# EAGLE schematic BK8000L BREADBOARD BUDDY (EAGLE 7.6.0)
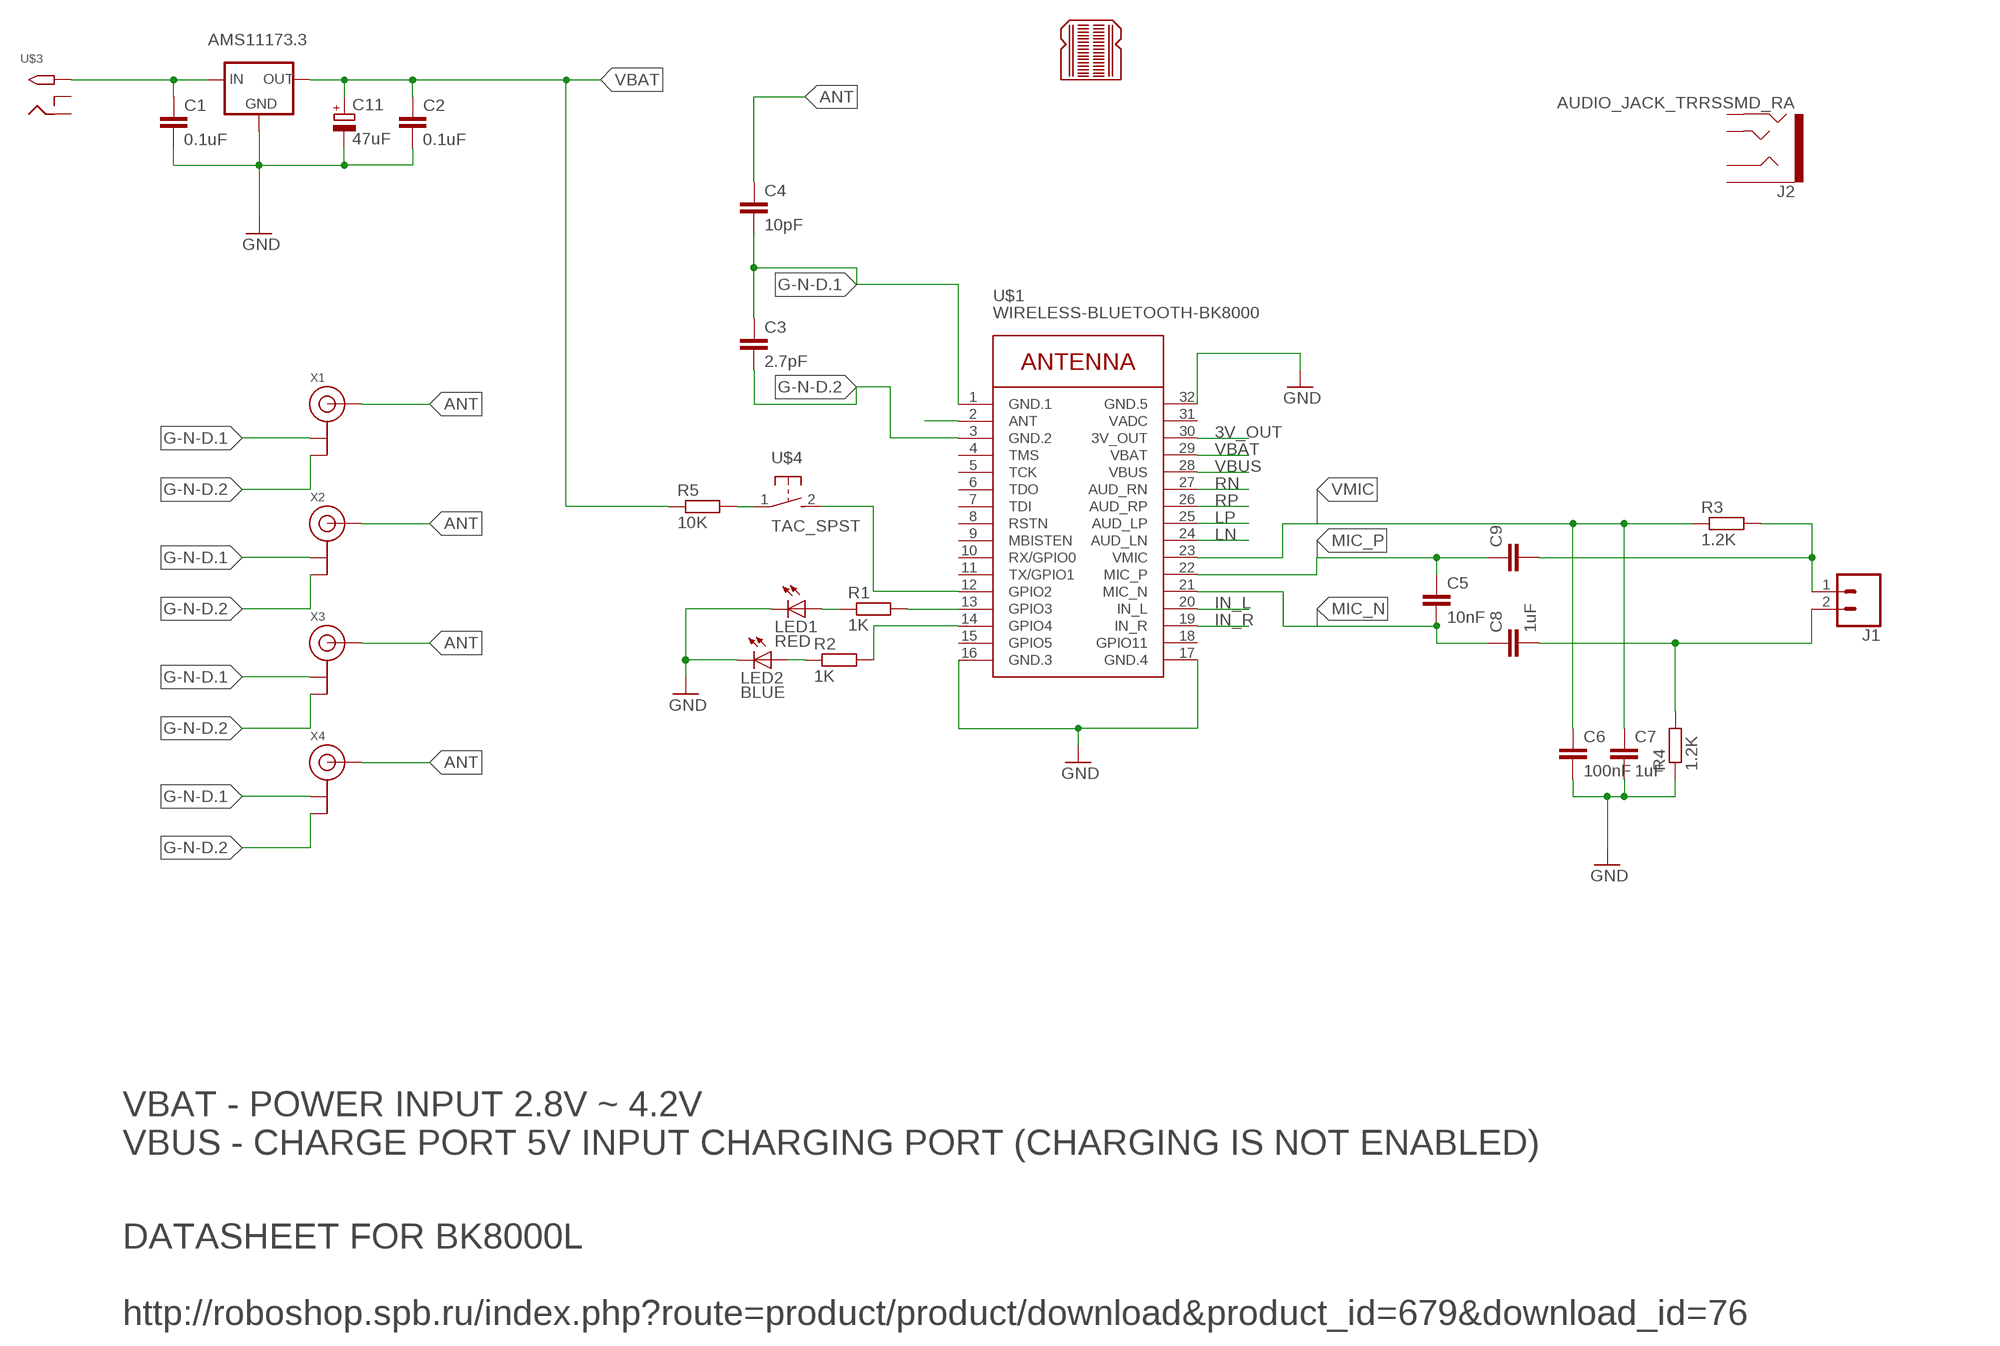
[diagram p0: schematic, sheet 1]

## Parts
C1  0.1uF  C-EUC1206  [C1206]
C2  0.1uF  C-EUC1206  [C1206]
C3  2.7pF  C-EUC1206  [C1206]
C4  10pF  C-EUC1206  [C1206]
C5  10nF  C-EUC0603  [C0603]
C6  100nF  C-EUC0603  [C0603]
C7  1uF  C-EUC0603  [C0603]
C8  1uF  C-EUC0603  [C0603]
C9  C-EUC0603  [C0603]
C11  47uF  CPOL-EUSMCD  [SMC_D]
J1  CONN_02LOCK  [1X02_LOCK]
J2  AUDIO_JACK_TRRSSMD_RA  [AUDIO_JACK_3.5MM_TRRS_SMD_RA]
LED1  RED  LEDCHIPLED_1206  [CHIPLED_1206]
LED2  BLUE  LEDCHIPLED_1206  [CHIPLED_1206]
LOGO1  BREADBOARD_PATTERN  [BREADBOARD_SPACING]
R1  1K  R-EU_R1206  [R1206]
R2  1K  R-EU_R1206  [R1206]
R3  1.2K  R-EU_R0603  [R0603]
R4  1.2K  R-EU_R0603  [R0603]
R5  10K  R-EU_R0603  [R0603]
U$1  WIRELESS-BLUETOOTH-BK8000  [WIRELESS-BLUETOOTH-BK8000]
U$2  AMS11173.3  [SOT223]
U$3  2.1MMJACKMTS  [PJ-102B]
U$4  TAC_SPST  [TACTILE-SPST]
X1  ANTENNA_U.FL  [U.FL]
X2  ANTENNA_U.FL  [U.FL]
X3  ANTENNA_U.FL  [U.FL]
X4  ANTENNA_U.FL  [U.FL]

## Nets
3V_OUT: U$1.30(3V_OUT)
ANT: C4.1 U$1.2(ANT) X1.3(SIGNAL) X2.3(SIGNAL) X3.3(SIGNAL) X4.3(SIGNAL)
G-N-D.1: C3.1 C4.2 U$1.1(GND.1) X1.1(GND) X2.1(GND) X3.1(GND) X4.1(GND)
G-N-D.2: C3.2 U$1.3(GND.2) X1.2(GND) X2.2(GND) X3.2(GND) X4.2(GND)
GND: C1.2 C2.2 C6.2 C7.2 C11.- LED1.C LED2.C R4.1 U$1.16(GND.3) U$1.17(GND.4) U$1.32(GND.5) U$2.1(GND)
IN_L: U$1.20(IN_L)
IN_R: U$1.19(IN_R)
LN: U$1.24(AUD_LN)
LP: U$1.25(AUD_LP)
MIC_N: C5.2 C8.1 U$1.21(MIC_N)
MIC_P: C5.1 C9.1 U$1.22(MIC_P)
N$1: C1.1 U$2.3(IN) U$3.TIP
N$2: C9.2 J1.1 R3.2
N$3: R5.2 U$4.1
N$4: C8.2 J1.2 R4.2
N$5: LED1.A R1.1
N$6: R1.2 U$1.13(GPIO3)
N$7: R2.2 U$1.14(GPIO4)
N$8: LED2.A R2.1
N$9: U$1.12(GPIO2) U$4.2
RN: U$1.27(AUD_RN)
RP: U$1.26(AUD_RP)
VBAT: C2.1 C11.+ R5.1 U$1.29(VBAT) U$2.2(OUT) U$2.4(OUT)
VBUS: U$1.28(VBUS)
VMIC: C6.1 C7.1 R3.1 U$1.23(VMIC)
Unconnected: J2.EARTH J2.RING1 J2.RING2 J2.TIP U$1.4(TMS) U$1.5(TCK) U$1.6(TDO) U$1.7(TDI) U$1.8(RSTN) U$1.9(MBISTEN) U$1.10(RX/GPIO0) U$1.11(TX/GPIO1) U$1.15(GPIO5) U$1.18(GPIO11) U$3.RING U$3.RING_SW

## Notes on the sheet
- VBAT - POWER INPUT 2.8V ~ 4.2V
  VBUS - CHARGE PORT 5V INPUT CHARGING PORT (CHARGING IS NOT ENABLED)
- DATASHEET FOR BK8000L
  
  http://roboshop.spb.ru/index.php?route=product/product/download&product_id=679&download_id=76

## Power pins joined to a net without a drawn wire
VADC: U$1.31(VADC)

## Library data of the parts
C1-C9 = rcl:C-EU: CAPACITOR, European symbol
C11 = rcl:CPOL-EU: POLARIZED CAPACITOR, European symbol
J1 = SparkFun-Connectors:CONN_02: Multi connection point. Often used as Generic Header-pin footprint for 0.1 inch spaced/style header connections On any of the 0.1 inch spaced packages, you can populate with these: Break Away Headers - Straight <https://www.sparkfun.com/products/116> (PRT-00116) Break Away Male Headers - Right Angle <https://www.sparkfun.com/products/553> (PRT-00553) Female Headers <https://www.sparkfun.com/products/115> (PRT-00115) Break Away Headers - Machine Pin <https://www.sparkfun.com/products/117> (PRT-00117) Break Away Female Headers - Swiss Machine Pin <https://www.sparkfun.com/products/743> (PRT-00743) For SCREWTERMINALS and SPRING TERMINALS visit here: Screw Terimnals on SparkFun.com <https://www.sparkfun.com/search/results?term=Screw+Terminals> (5mm/3.5mm/2.54mm spacing) This device is also useful as a general connection point to wire up your design to another part of your project. Our various solder wires solder well into these plated through hole pads. Hook-Up Wire - Assortment (Stranded, 22 AWG) <https://www.sparkfun.com/products/11375> (PRT-11375) Hook-Up Wire - Assortment (Solid Core, 22 AWG) <https://www.sparkfun.com/products/11367> (PRT-11367) View the entire wire category on our website here <https://www.sparkfun.com/categories/141> Special notes: Molex polarized connector foot print use with: PRT-08233 with associated crimp pins and housings. 2.54_SCREWTERM for use with PRT-10571. 3.5mm Screw Terminal footprints for PRT-08084 5mm Screw Terminal footprints for use with PRT-08432
J2 = SparkFun-Connectors:AUDIO_JACK_TRRS: Audio Jack - 3.5mm TRRS (SMD) This is a 3.5mm TRRS SMD audio jack. TRRS connectors are the audio-style connectors that you see on some phones, MP3 players and development boards. TRRS stands for “tip, ring, ring, sleeve,” which reflects that this has three conductors and a ground. SparkFun Products: Audio Jack <https://www.sparkfun.com/products/12639> mbed Starter Kit <https://www.sparkfun.com/products/12968> SparkFun TRRS 3.5mm Jack Breakout <https://www.sparkfun.com/products/11570>; PROD_ID: CONN-10676; SF_ID: PRT-12639
LED1 LED2 = led:LED: LED OSRAM: - CHIPLED LG R971, LG N971, LY N971, LG Q971, LY Q971, LO R971, LY R971 LH N974, LH R974 LS Q976, LO Q976, LY Q976 LO Q996 - Hyper CHIPLED LW Q18S LB Q993, LB Q99A, LB R99A - SideLED LS A670, LO A670, LY A670, LG A670, LP A670 LB A673, LV A673, LT A673, LW A673 LH A674 LY A675 LS A676, LA A676, LO A676, LY A676, LW A676 LS A679, LY A679, LG A679 - Hyper Micro SIDELED® LS Y876, LA Y876, LO Y876, LY Y876 LT Y87S - SmartLED LW L88C, LW L88S LB L89C, LB L89S, LG L890 LS L89K, LO L89K, LY L89K LS L896, LA L896, LO L896, LY L896 - TOPLED LS T670, LO T670, LY T670, LG T670, LP T670 LSG T670, LSP T670, LSY T670, LOP T670, LYG T670 LG T671, LOG T671, LSG T671 LB T673, LV T673, LT T673, LW T673 LH T674 LS T676, LA T676, LO T676, LY T676, LB T676, LH T676, LSB T676, LW T676 LB T67C, LV T67C, LT T67C, LS T67K, LO T67K, LY T67K, LW E67C LS E67B, LA E67B, LO E67B, LY E67B, LB E67C, LV E67C, LT E67C LW T67C LS T679, LY T679, LG T679 LS T770, LO T770, LY T770, LG T770, LP T770 LB T773, LV T773, LT T773, LW T773 LH T774 LS E675, LA E675, LY E675, LS T675 LS T776, LA T776, LO T776, LY T776, LB T776 LHGB T686 LT T68C, LB T68C - Hyper Mini TOPLED® LB M676 - Mini TOPLED Santana® LG M470 LS M47K, LO M47K, LY M47K Source: http://www.osram.convergy.de LUXEON: - LUMILED® LXK2-PW12-R00, LXK2-PW12-S00, LXK2-PW14-U00, LXK2-PW14-V00 LXK2-PM12-R00, LXK2-PM12-S00, LXK2-PM14-U00 LXK2-PE12-Q00, LXK2-PE12-R00, LXK2-PE12-S00, LXK2-PE14-T00, LXK2-PE14-U00 LXK2-PB12-K00, LXK2-PB12-L00, LXK2-PB12-M00, LXK2-PB14-N00, LXK2-PB14-P00, LXK2-PB14-Q00 LXK2-PR12-L00, LXK2-PR12-M00, LXK2-PR14-Q00, LXK2-PR14-R00 LXK2-PD12-Q00, LXK2-PD12-R00, LXK2-PD12-S00 LXK2-PH12-R00, LXK2-PH12-S00 LXK2-PL12-P00, LXK2-PL12-Q00, LXK2-PL12-R00 Source: www.luxeon.com KINGBRIGHT: KA-3528ASYC Source: www.kingbright.com
LOGO1 = SparkFun-Aesthetics:BREADBOARD_PATTERN: Breadboard-Spacing Reference tDoc reference markings that correspond to solderless breadboard row spacing. Includes power rails and void space between rows.
R1-R5 = rcl:R-EU_: RESISTOR, European symbol
U$1 = diy-modules:WIRELESS-BLUETOOTH-BK8000: Bluetooth Audio Module based on BK8000L chip More details available here: http://www.electrodragon.com/w/BK8000L Click here to find device on ebay.com <http://www.ebay.com/sch/bk8000l+module>
U$2 = MTS-OTR_Custom:AMS11173.3: This is a 3.3V SMD voltage regulator rated for 1Amp output
U$3 = MTS-OTR_Custom:2.1MMJACK: 2.1mm x 5.5mm THM DC jack with internal switch. Digikey part #PJ-102A, 4UCON part #05537 2.1mm x 5.5mm SMT DC jack with internal switch. Digikey part #PJ-002A-SMT, 4UCON part #03267 By microbuilder.eu & adafruit.com
U$4 = MTS-OTR_Custom:TAC_SPST: Tactile switch SPST 7mm lead spacing
X1-X4 = adafruit:ANTENNA_U.FL: U.FL Antenna Connector